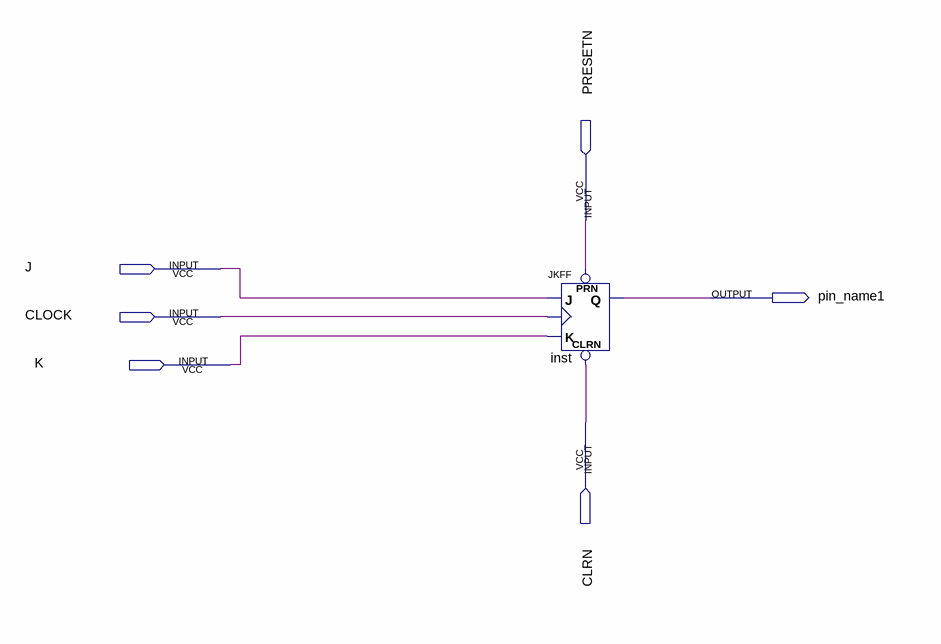
[diagram p0: schematic sheet]
// Quartus schematic FlipFlopJK.bdf as structural Verilog: 1 symbols, 6 pins
module FlipFlopJK (
  input  PRESETN,
  input  J,
  input  CLOCK,
  input  K,
  input  CLRN,
  output pin_name1
);

  JKFF inst (.PRN(PRESETN), .CLRN(CLRN), .K(K), .J(J), .CLK(CLOCK), .Q(pin_name1));
endmodule
